# Altium schematic sheet Sound_Card.SchDoc: Stereo Sound Card
size Tabloid; Date: 03/13/2023; Engineer: Terry D. Schevker; Revision: 1.0; SheetNumber: 1; SheetTotal: 4
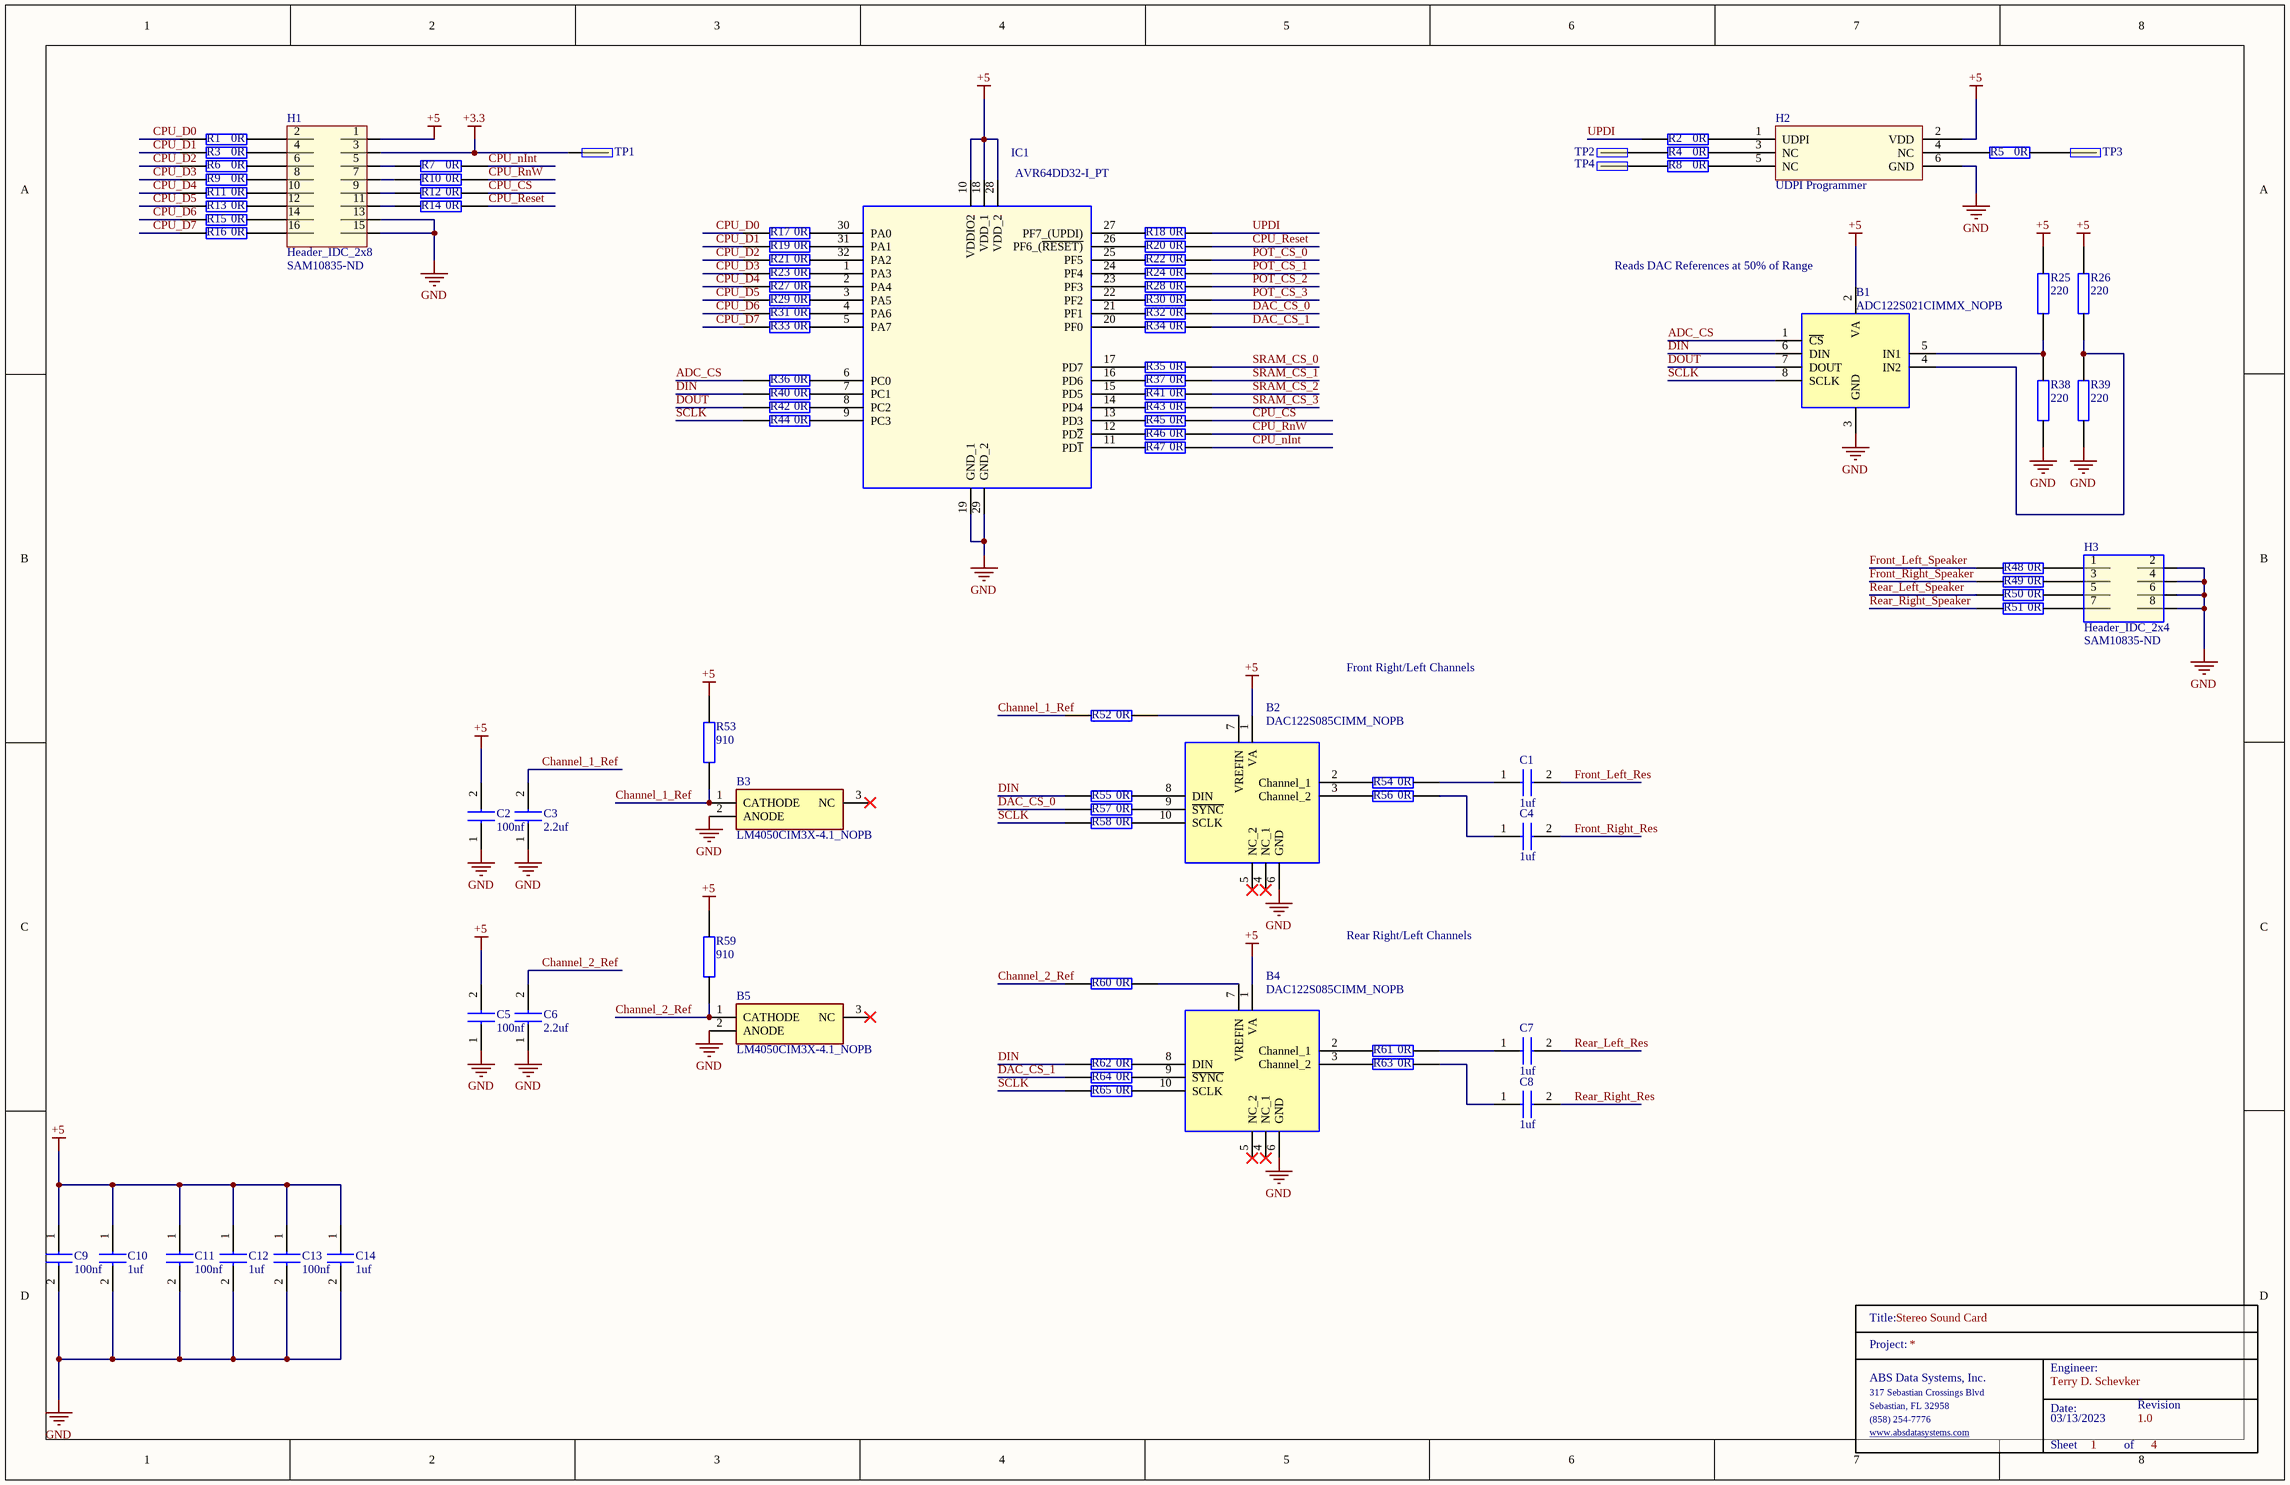
[diagram p0: Sound_Card.SchDoc]

## Parts
B1  ADC122S021CIMMX_NOPB  [SOP65P490X110-8N]
B2  DAC122S085CIMM_NOPB  [SOP50P490X110-10N]
B3  LM4050CIM3X-4.1_NOPB  [SOT95P237X95-3N]
B4  DAC122S085CIMM_NOPB  [SOP50P490X110-10N]
B5  LM4050CIM3X-4.1_NOPB  [SOT95P237X95-3N]
C1  1uf  [0603]
C2  100nf  [0603]
C3  2.2uf  [0603]
C4  1uf  [0603]
C5  100nf  [0603]
C6  2.2uf  [0603]
C7  1uf  [0603]
C8  1uf  [0603]
C9  100nf  [0603]
C10  1uf  [0603]
C11  100nf  [0603]
C12  1uf  [0603]
C13  100nf  [0603]
C14  1uf  [0603]
H1  Header_IDC_2x8  Supplier Part Number 1: SAM10835-ND  [HEADER16]
H2  UDPI Programmer  [HDR2X3]
H3  Header_IDC_2x4  Supplier Part Number 1: SAM10835-ND  [HDR2X4]
IC1  AVR64DD32-I_PT  [QFP80P900X900X120-32N]
R1  0R  [0603]
R2  0R  [0603]
R3  0R  [0603]
R4  0R  [0603]
R5  0R  [0603]
R6  0R  [0603]
R7  0R  [0603]
R8  0R  [0603]
R9  0R  [0603]
R10  0R  [0603]
R11  0R  [0603]
R12  0R  [0603]
R13  0R  [0603]
R14  0R  [0603]
R15  0R  [0603]
R16  0R  [0603]
R17  0R  [0603]
R18  0R  [0603]
R19  0R  [0603]
R20  0R  [0603]
R21  0R  [0603]
R22  0R  [0603]
R23  0R  [0603]
R24  0R  [0603]
R25  220  [0603]
R26  220  [0603]
R27  0R  [0603]
R28  0R  [0603]
R29  0R  [0603]
R30  0R  [0603]
R31  0R  [0603]
R32  0R  [0603]
R33  0R  [0603]
R34  0R  [0603]
R35  0R  [0603]
R36  0R  [0603]
R37  0R  [0603]
R38  220  [0603]
R39  220  [0603]
R40  0R  [0603]
R41  0R  [0603]
R42  0R  [0603]
R43  0R  [0603]
R44  0R  [0603]
R45  0R  [0603]
R46  0R  [0603]
R47  0R  [0603]
R48  0R  [0603]
R49  0R  [0603]
R50  0R  [0603]
R51  0R  [0603]
R52  0R  [0603]
R53  910  [0603]
R54  0R  [0603]
R55  0R  [0603]
R56  0R  [0603]
R57  0R  [0603]
R58  0R  [0603]
R59  910  [0603]
R60  0R  [0603]
R61  0R  [0603]
R62  0R  [0603]
R63  0R  [0603]
R64  0R  [0603]
R65  0R  [0603]
TitleBlock_1  TitleBlock  (value not drawn)  (graphical)
TP1  TP  [TP]  (value not drawn)
TP2  TP  [TP]  (value not drawn)
TP3  TP  [TP]  (value not drawn)
TP4  TP  [TP]  (value not drawn)

## Nets
+3.3: H1.3 TP1.1
+5: B1.2(VA) B2.1(VA) B4.1(VA) C2.2 C5.2 C9.1 C10.1 C11.1 C12.1 C13.1 C14.1 H1.1 H2.2(VDD) IC1.10(VDDIO2) IC1.18(VDD_1) IC1.28(VDD_2) R25.1 R26.2 R53.1 R59.1
GND: B1.3(GND) B2.6(GND) B3.2(ANODE) B4.6(GND) B5.2(ANODE) C2.1 C3.1 C5.1 C6.1 C9.2 C10.2 C11.2 C12.2 C13.2 C14.2 H1.13 H1.15 H2.6(GND) H3.2 H3.4 H3.6 H3.8 IC1.19(GND_1) IC1.29(GND_2) R38.1 R39.2
ADC_CS: B1.1(~{CS}) R36.1
Channel_1_Ref: B3.1(CATHODE) C3.2 R52.1 R53.2
Channel_2_Ref: B5.1(CATHODE) C6.2 R59.2 R60.1
CPU_CS: R12.2 R45.2
CPU_D0: R1.1 R17.1
CPU_D1: R3.1 R19.1
CPU_D2: R6.1 R21.1
CPU_D3: R9.1 R23.1
CPU_D4: R11.1 R27.1
CPU_D5: R13.1 R29.1
CPU_D6: R15.1 R31.1
CPU_D7: R16.1 R33.1
CPU_nInt: R7.2 R47.2
CPU_Reset: R14.2 R20.2
CPU_RnW: R10.2 R46.2
DAC_CS_0: R32.2 R57.1
DAC_CS_1: R34.2 R64.1
DIN: B1.6(DIN) R40.1 R55.1 R62.1
DOUT: B1.7(DOUT) R42.1
Front_Left_Res: C1.2
Front_Left_Speaker: R48.1
Front_Right_Res: C4.2
Front_Right_Speaker: R49.1
POT_CS_0: R22.2
POT_CS_1: R24.2
POT_CS_2: R28.2
POT_CS_3: R30.2
Rear_Left_Res: C7.2
Rear_Left_Speaker: R50.1
Rear_Right_Res: C8.2
Rear_Right_Speaker: R51.1
SCLK: B1.8(SCLK) R44.1 R58.1 R65.1
SRAM_CS_0: R35.2
SRAM_CS_1: R37.2
SRAM_CS_2: R41.2
SRAM_CS_3: R43.2
UPDI: R2.1 R18.2
NetB1_4: B1.4(IN2) R26.1 R39.1
NetB1_5: B1.5(IN1) R25.2 R38.2
NetB2_2: B2.2(Channel_1) R54.1
NetB2_3: B2.3(Channel_2) R56.1
NetB2_7: B2.7(VREFIN) R52.2
NetB2_8: B2.8(DIN) R55.2
NetB2_9: B2.9(~{SYNC}) R57.2
NetB2_10: B2.10(SCLK) R58.2
NetB4_2: B4.2(Channel_1) R61.1
NetB4_3: B4.3(Channel_2) R63.1
NetB4_7: B4.7(VREFIN) R60.2
NetB4_8: B4.8(DIN) R62.2
NetB4_9: B4.9(~{SYNC}) R64.2
NetB4_10: B4.10(SCLK) R65.2
NetC1_1: C1.1 R54.2
NetC4_1: C4.1 R56.2
NetC7_1: C7.1 R61.2
NetC8_1: C8.1 R63.2
NetH1_2: H1.2 R1.2
NetH1_4: H1.4 R3.2
NetH1_5: H1.5 R7.1
NetH1_6: H1.6 R6.2
NetH1_7: H1.7 R10.1
NetH1_8: H1.8 R9.2
NetH1_9: H1.9 R12.1
NetH1_10: H1.10 R11.2
NetH1_11: H1.11 R14.1
NetH1_12: H1.12 R13.2
NetH1_14: H1.14 R15.2
NetH1_16: H1.16 R16.2
NetH2_1: H2.1(UDPI) R2.2
NetH2_3: H2.3(NC) R4.2
NetH2_4: H2.4(NC) R5.1
NetH2_5: H2.5(NC) R8.2
NetH3_1: H3.1 R48.2
NetH3_3: H3.3 R49.2
NetH3_5: H3.5 R50.2
NetH3_7: H3.7 R51.2
NetIC1_1: IC1.1(PA3) R23.2
NetIC1_2: IC1.2(PA4) R27.2
NetIC1_3: IC1.3(PA5) R29.2
NetIC1_4: IC1.4(PA6) R31.2
NetIC1_5: IC1.5(PA7) R33.2
NetIC1_6: IC1.6(PC0) R36.2
NetIC1_7: IC1.7(PC1) R40.2
NetIC1_8: IC1.8(PC2) R42.2
NetIC1_9: IC1.9(PC3) R44.2
NetIC1_11: IC1.11(PD~{1}) R47.1
NetIC1_12: IC1.12(PD~{2}) R46.1
NetIC1_13: IC1.13(PD3) R45.1
NetIC1_14: IC1.14(PD4) R43.1
NetIC1_15: IC1.15(PD5) R41.1
NetIC1_16: IC1.16(PD6) R37.1
NetIC1_17: IC1.17(PD7) R35.1
NetIC1_20: IC1.20(PF0) R34.1
NetIC1_21: IC1.21(PF1) R32.1
NetIC1_22: IC1.22(PF2) R30.1
NetIC1_23: IC1.23(PF3) R28.1
NetIC1_24: IC1.24(PF4) R24.1
NetIC1_25: IC1.25(PF5) R22.1
NetIC1_26: IC1.26(PF6_(~{RESET)}) R20.1
NetIC1_27: IC1.27(PF7_(UPDI)) R18.1
NetIC1_30: IC1.30(PA0) R17.2
NetIC1_31: IC1.31(PA1) R19.2
NetIC1_32: IC1.32(PA2) R21.2
NetR4_1: R4.1 TP2.1
NetR5_2: R5.2 TP3.1
NetR8_1: R8.1 TP4.1

Not connected (* = marked no-connect by the designer): B2 4(NC_1)* 5(NC_2)*; B3 3(NC)*; B4 4(NC_1)* 5(NC_2)*; B5 3(NC)*

## Notes on the sheet
- (near B1) Reads DAC References at 50% of Range
- Front Right/Left Channels
- Rear Right/Left Channels
- (in symbol TitleBlock) Title:; Project:; Engineer:; ABS Data Systems, Inc.; 317 Sebastian Crossings Blvd; Sebastian, FL 32958; Date:; Revision; (858) 254-7776; www.absdatasystems.com; Sheet; of

## Library data of the parts
B1 = ADC122S021CIMMX_NOPB: 2 Channel, 50 ksps to 200 ksps 12-Bit A/D Converter; Manufacturer_Name: Texas Instruments; Manufacturer_Part_Number: ADC122S021CIMMX/NOPB; Geometry.Height: 1.1mm; Mouser Part Number: 926-A122S021CIMMXNPB; Mouser Price/Stock: https://www.mouser.co.uk/ProductDetail/Texas-Instruments/ADC122S021CIMMX-NOPB/?qs=7X5t%252BdzoRHB2bC7Teu8H3A%3D%3D; Datasheet Link: http://www.ti.com/lit/gpn/ADC122S021
B2 B4 = DAC122S085CIMM_NOPB: 12-Bit Micro Power DUAL Digital-to-Analog Converter with Rail-to-Rail Output; Manufacturer_Name: Texas Instruments; Manufacturer_Part_Number: DAC122S085CIMM/NOPB; Geometry.Height: 1.1mm; Mouser Part Number: 926-DAC122S085CIMMNO; Mouser Price/Stock: https://www.mouser.co.uk/ProductDetail/Texas-Instruments/DAC122S085CIMM-NOPB/?qs=7X5t%252BdzoRHCSswOz%252BE6yGA%3D%3D; Datasheet Link: http://www.ti.com/lit/gpn/dac122s085
B3 B5 = LM4050CIM3X-4.1_NOPB: 50ppm/C Precision Micropower Shunt Voltage Reference; Manufacturer_Name: Texas Instruments; Manufacturer_Part_Number: LM4050CIM3X-4.1/NOPB; Geometry.Height: 0.95mm; Mouser Part Number: 926-LM4050CIM3X41NPB; Mouser Price/Stock: https://www.mouser.co.uk/ProductDetail/Texas-Instruments/LM4050CIM3X-4.1-NOPB?qs=QbsRYf82W3Em%2F29oRlpByg%3D%3D; Datasheet Link: http://www.ti.com/lit/gpn/lm4050-n
C1 C4 C7 C8 C10 C12 C14 = CL10B105KA8NNNL: Samsung Electro-Mechanics 0603 1uf
C2 C5 C9 C11 C13 = CL10B104JB8NNNC: Samsung Electro-Mechanics 0603 100nf
C3 C6 = CL10B225KP8NNNC: Samsung Electro-Mechanics 0603 2.2uf
H1 = Header_IDC_2x8: 16 Pin 2x8 Through Hold IDC Connector; Manufacturer: Samtec; Manufacturer Part Number: TST-108-01-G-D; Number of Contacts: 16; Gender: Male; Connector Type: Male Pin; Pitch: 2.54mm; Row Spacing: 0.1inch; Supplier 1: Digi-Key; RoHS: Yes; Category: Headers and Wire Housings; Stock 1: 227; Pricing 1: 1=2.85000, 10=2.73600, 100=2.28000, 500=1.93800, 1000=1.65300, 5000=1.48200 (USD); Mount: Through Hole; Contact Plating: Gold; Contact Material: Bronze; Housing Material: Polyester; Housing Color: Black; Color: Black; Min Operating Temperature: -55°C; Max Operating Temperature: 125°C; Number of Rows: 2; Termination: Solder; Packaging: Rail/Tube; Orientation: Straight; Number of Positions: 16; Length: 27.94mm; Depth: 9.27mm; Contact Mating Length: 0.25inch; REACH SVHC: No SVHC; ComponentLink1URL: https://datasheet.ciiva.com/739/tst-mkt-739845.pdf?src-supplier=Digi-Key; ComponentLink1Description: https://datasheet.ciiva.com/739/tst-mkt-739845.pdf?src-supplier=Digi-Key; ComponentLink2URL: https://datasheet.ciiva.com/10018/htst-10018510.pdf?src-supplier=Avnet; ComponentLink2Description: https://datasheet.ciiva.com/10018/htst-10018510.pdf?src-supplier=Avnet
H2 = UDPI Programmer: 6 Pin 2X3 Through Hole Header
H3 = Header_IDC_2x4: 8 Pin 2x4 Through Hold IDC Connector; Manufacturer: Samtec; Manufacturer Part Number: TST-105-01-G-D; Number of Contacts: 16; Gender: Male; Connector Type: Male Pin; Pitch: 2.54mm; Row Spacing: 0.1inch; Supplier 1: Digi-Key; RoHS: Yes; Category: Headers and Wire Housings; Stock 1: 227; Pricing 1: 1=2.85000, 10=2.73600, 100=2.28000, 500=1.93800, 1000=1.65300, 5000=1.48200 (USD); Mount: Through Hole; Contact Plating: Gold; Contact Material: Bronze; Housing Material: Polyester; Housing Color: Black; Color: Black; Min Operating Temperature: -55°C; Max Operating Temperature: 125°C; Number of Rows: 2; Termination: Solder; Packaging: Rail/Tube; Orientation: Straight; Number of Positions: 16; Length: 27.94mm; Depth: 9.27mm; Contact Mating Length: 0.25inch; REACH SVHC: No SVHC; ComponentLink1URL: https://datasheet.ciiva.com/739/tst-mkt-739845.pdf?src-supplier=Digi-Key; ComponentLink1Description: https://datasheet.ciiva.com/739/tst-mkt-739845.pdf?src-supplier=Digi-Key; ComponentLink2URL: https://datasheet.ciiva.com/10018/htst-10018510.pdf?src-supplier=Avnet; ComponentLink2Description: https://datasheet.ciiva.com/10018/htst-10018510.pdf?src-supplier=Avnet
IC1 = AVR64DD32-I_PT: Integrated Circuit; Manufacturer_Name: Microchip; Manufacturer_Part_Number: AVR64DD32-I/PT | MULTI-VOLTAGE I/O; Datasheet Link: https://www.microchip.com/en-us/product/AVR64DD32; Height: 1.2mm
R1-R24 R27-R37 R40-R52 R54-R58 R60-R65 = RC0603JR-070RL: YAGEO 0603 0 ohm; Manufacturer_Name: KEMET; Geometry.Height: 0.55mm; Mouser Part Number: 603-RC0603JR-070RL; Mouser Price/Stock: https://www.mouser.co.uk/ProductDetail/YAGEO/RC0603JR-070RL?qs=2cAdsCoAWRGWyPcuXgGiXQ%3D%3D; Manufacturer_Part_Number: RC0603JR-070RL; Datasheet Link: https://datasheet.datasheetarchive.com/originals/distributors/Datasheets_SAMA/902f9e387b938f871d31120f5fc1d65e.pdf
R25 R26 R38 R39 = RC0603JR-07220RL: YAGEO 0603 220 ohm; Manufacturer_Name: KEMET; Manufacturer_Part_Number: RC0603JR-070RL; Geometry.Height: 0.55mm; Mouser Part Number: 603-RC0603JR-070RL; Mouser Price/Stock: https://www.mouser.co.uk/ProductDetail/YAGEO/RC0603JR-070RL?qs=2cAdsCoAWRGWyPcuXgGiXQ%3D%3D; Datasheet Link: https://datasheet.datasheetarchive.com/originals/distributors/Datasheets_SAMA/902f9e387b938f871d31120f5fc1d65e.pdf
R53 R59 = RT0603BRC07910RL: YAGEO 0603 910 ohm; Manufacturer_Name: KEMET; Manufacturer_Part_Number: RC0603JR-070RL; Geometry.Height: 0.55mm; Mouser Part Number: 603-RC0603JR-070RL; Mouser Price/Stock: https://www.mouser.co.uk/ProductDetail/YAGEO/RC0603JR-070RL?qs=2cAdsCoAWRGWyPcuXgGiXQ%3D%3D; Datasheet Link: https://datasheet.datasheetarchive.com/originals/distributors/Datasheets_SAMA/902f9e387b938f871d31120f5fc1d65e.pdf
TP1-TP4 = TP: Manufacturer: Samtec; Manufacturer Part Number: TST-105-01-G-D; Number of Contacts: 16; Gender: Male; Connector Type: Male Pin; Pitch: 2.54mm; Row Spacing: 0.1inch; Supplier 1: Digi-Key; RoHS: Yes; Category: Headers and Wire Housings; Stock 1: 227; Pricing 1: 1=2.85000, 10=2.73600, 100=2.28000, 500=1.93800, 1000=1.65300, 5000=1.48200 (USD); Mount: Through Hole; Contact Plating: Gold; Contact Material: Bronze; Housing Material: Polyester; Housing Color: Black; Color: Black; Min Operating Temperature: -55°C; Max Operating Temperature: 125°C; Number of Rows: 2; Termination: Solder; Packaging: Rail/Tube; Orientation: Straight; Number of Positions: 16; Length: 27.94mm; Depth: 9.27mm; Contact Mating Length: 0.25inch; REACH SVHC: No SVHC; ComponentLink1URL: https://datasheet.ciiva.com/739/tst-mkt-739845.pdf?src-supplier=Digi-Key; ComponentLink1Description: https://datasheet.ciiva.com/739/tst-mkt-739845.pdf?src-supplier=Digi-Key; ComponentLink2URL: https://datasheet.ciiva.com/10018/htst-10018510.pdf?src-supplier=Avnet; ComponentLink2Description: https://datasheet.ciiva.com/10018/htst-10018510.pdf?src-supplier=Avnet